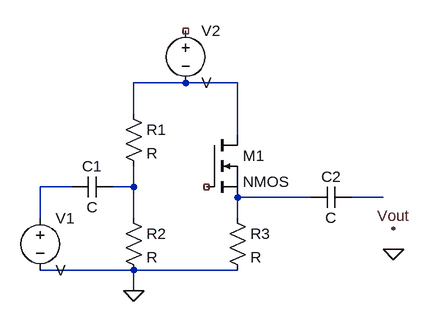
[diagram p0: schematic CD_S20210020323.asc]
CD_S20210020323.asc, the LTspice schematic file:
Version 4
SHEET 1 880 680
WIRE 176 -16 96 -16
WIRE 256 -16 176 -16
WIRE 96 32 96 -16
WIRE 256 64 256 -16
WIRE 0 144 -48 144
WIRE 96 144 96 112
WIRE 96 144 64 144
WIRE 368 160 256 160
WIRE 480 160 432 160
WIRE -48 192 -48 144
WIRE 96 192 96 144
WIRE 256 192 256 160
WIRE 96 272 -48 272
WIRE 256 272 96 272
WIRE 96 304 96 272
FLAG 96 304 0
FLAG 496 240 0
FLAG 496 208 Vout
SYMBOL res 80 16 R0
SYMATTR InstName R1
SYMBOL res 80 176 R0
SYMATTR InstName R2
SYMBOL res 240 176 R0
SYMATTR InstName R3
SYMBOL voltage -48 176 R0
SYMATTR InstName V1
SYMBOL voltage 176 -112 R0
SYMATTR InstName V2
SYMBOL cap 64 128 R90
WINDOW 0 0 32 VBottom 2
WINDOW 3 32 32 VTop 2
SYMATTR InstName C1
SYMBOL cap 432 144 R90
WINDOW 0 0 32 VBottom 2
WINDOW 3 32 32 VTop 2
SYMATTR InstName C2
SYMBOL nmos 208 64 R0
SYMATTR InstName M1

The netlist it stands for:
* CD_S20210020323.asc
R1 N001 N003 R
R2 N003 0 R
R3 N004 0 R
V1 N002 0 V
V2 NC_01 N001 V
C1 N003 N002 C
C2 N005 N004 C
M1 N001 NC_02 N004 N004 NMOS
.model NMOS NMOS
.model PMOS PMOS
.lib standard.mos
.backanno
.end